# Altium schematic sheet APC1_OBC.SchDoc
size A4
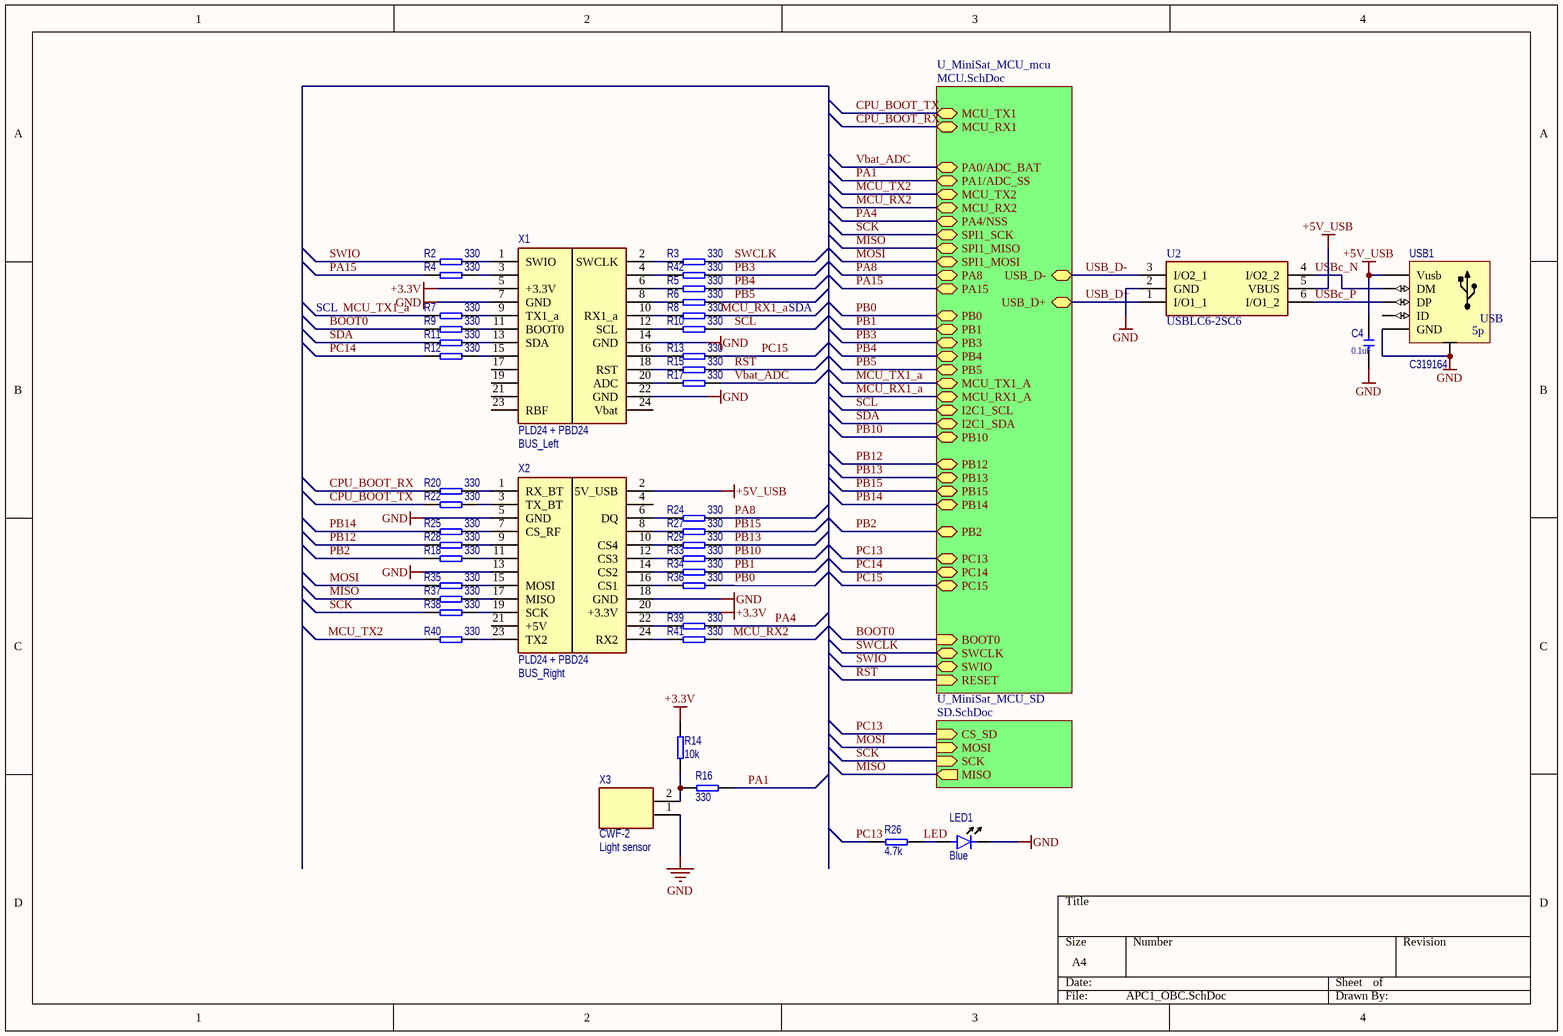
[diagram p0: APC1_OBC.SchDoc]

## Parts
C4  value 0.1uF  [CERCAP 0402]
LED1  value Blue  [LED 0603]
R2  value 330  [RES 0402]
R3  value 330  [RES 0402]
R4  value 330  [RES 0402]
R5  value 330  [RES 0402]
R6  value 330  [RES 0402]
R7  value 330  [RES 0402]
R8  value 330  [RES 0402]
R9  value 330  [RES 0402]
R10  value 330  [RES 0402]
R11  value 330  [RES 0402]
R12  value 330  [RES 0402]
R13  value 330  [RES 0402]
R14  value 10k  [RES 0402]
R15  value 330  [RES 0402]
R16  value 330  [RES 0603]
R17  value 330  [RES 0402]
R18  value 330  [RES 0402]
R20  value 330  [RES 0402]
R22  value 330  [RES 0402]
R24  value 330  [RES 0402]
R25  value 330  [RES 0402]
R26  value 4.7k  [RES 0402]
R27  value 330  [RES 0402]
R28  value 330  [RES 0402]
R29  value 330  [RES 0402]
R33  value 330  [RES 0402]
R34  value 330  [RES 0402]
R35  value 330  [RES 0402]
R36  value 330  [RES 0402]
R37  value 330  [RES 0402]
R38  value 330  [RES 0402]
R39  value 330  [RES 0402]
R40  value 330  [RES 0402]
R41  value 330  [RES 0402]
R42  value 330  [RES 0402]
U2  USBLC6-2SC6  [SOT-666]
USB1  C319164  [USB-Micro_TH]
X1  PLD24 + PBD24  Purpose: BUS_Left  [PICOSAT_CNN]
X2  PLD24 + PBD24  Purpose: BUS_Right  [PICOSAT_CNN]
X3  CWF-2  Purpose: Light sensor  [PBS-2-2.54]

## Sub-sheets
U_MiniSat_MCU_mcu = MCU.SchDoc: RESET (in), USB_D+ (bidir), USB_D- (bidir), PB12 (bidir), PB3 (bidir), PB5 (bidir), PA15 (bidir), PB0 (bidir), PB1 (bidir), PB4 (bidir), PB10 (bidir), PA0/ADC_BAT (bidir), PA1/ADC_SS (bidir), PA8 (bidir), SWIO (bidir), SWCLK (bidir), PC13 (bidir), PC15 (bidir), PC14 (bidir), PB13 (bidir), PB15 (bidir), PB14 (bidir), BOOT0 (in), I2C1_SDA (bidir), PA4/NSS (bidir), MCU_TX1 (bidir), MCU_RX1 (bidir), MCU_TX2 (bidir), MCU_RX2 (bidir), PB2 (bidir), SPI1_SCK (bidir), SPI1_MOSI (bidir), SPI1_MISO (bidir), I2C1_SCL (bidir), MCU_RX1_A (bidir), MCU_TX1_A (bidir)
U_MiniSat_MCU_SD = SD.SchDoc: CS_SD (in), MOSI (in), SCK (in), MISO (out)

## Nets
+3.3V: R14.2 X1.5(+3.3V) X2.20(+3.3V)
+5V_USB: C4.2 U2.5(VBUS) USB1.Vusb X2.2(5V_USB)
GND: C4.1 LED1.2(Cathode) U2.2(GND) USB1.GND USB1.TH X1.7(GND) X1.14(GND) X1.22(GND) X2.5(GND) X2.13 X2.18(GND) X3.1
BOOT0: R9.1 ; sheet U_MiniSat_MCU_mcu/BOOT0
CPU_BOOT_RX: R20.1 ; sheet U_MiniSat_MCU_mcu/MCU_RX1
CPU_BOOT_TX: R22.1 ; sheet U_MiniSat_MCU_mcu/MCU_TX1
LED: LED1.1(Anode) R26.2
MCU_RX1_a: R8.2 ; sheet U_MiniSat_MCU_mcu/MCU_RX1_A
MCU_RX2: R41.2 ; sheet U_MiniSat_MCU_mcu/MCU_RX2
MCU_TX1_a: R7.1 ; sheet U_MiniSat_MCU_mcu/MCU_TX1_A
MCU_TX2: R40.1 ; sheet U_MiniSat_MCU_mcu/MCU_TX2
MISO: R37.1 ; sheet U_MiniSat_MCU_mcu/SPI1_MISO, sheet U_MiniSat_MCU_SD/MISO
MOSI: R35.1 ; sheet U_MiniSat_MCU_mcu/SPI1_MOSI, sheet U_MiniSat_MCU_SD/MOSI
PA1: R16.1 ; sheet U_MiniSat_MCU_mcu/PA1/ADC_SS
PA4: R39.2 ; sheet U_MiniSat_MCU_mcu/PA4/NSS
PA8: R24.2 ; sheet U_MiniSat_MCU_mcu/PA8
PA15: R4.1 ; sheet U_MiniSat_MCU_mcu/PA15
PB0: R36.2 ; sheet U_MiniSat_MCU_mcu/PB0
PB1: R34.2 ; sheet U_MiniSat_MCU_mcu/PB1
PB2: R18.1 ; sheet U_MiniSat_MCU_mcu/PB2
PB3: R42.2 ; sheet U_MiniSat_MCU_mcu/PB3
PB4: R5.2 ; sheet U_MiniSat_MCU_mcu/PB4
PB5: R6.2 ; sheet U_MiniSat_MCU_mcu/PB5
PB10: R33.2 ; sheet U_MiniSat_MCU_mcu/PB10
PB12: R28.1 ; sheet U_MiniSat_MCU_mcu/PB12
PB13: R29.2 ; sheet U_MiniSat_MCU_mcu/PB13
PB14: R25.1 ; sheet U_MiniSat_MCU_mcu/PB14
PB15: R27.2 ; sheet U_MiniSat_MCU_mcu/PB15
PC13: R26.1 ; sheet U_MiniSat_MCU_mcu/PC13, sheet U_MiniSat_MCU_SD/CS_SD
PC14: R12.1 ; sheet U_MiniSat_MCU_mcu/PC14
PC15: R13.2 ; sheet U_MiniSat_MCU_mcu/PC15
RST: R15.2 ; sheet U_MiniSat_MCU_mcu/RESET
SCK: R38.1 ; sheet U_MiniSat_MCU_mcu/SPI1_SCK, sheet U_MiniSat_MCU_SD/SCK
SCL: R10.2 ; sheet U_MiniSat_MCU_mcu/I2C1_SCL
SDA: R11.1 ; sheet U_MiniSat_MCU_mcu/I2C1_SDA
SWCLK: R3.2 ; sheet U_MiniSat_MCU_mcu/SWCLK
SWIO: R2.1 ; sheet U_MiniSat_MCU_mcu/SWIO
USB_D+: U2.1(I/O1_1) ; sheet U_MiniSat_MCU_mcu/USB_D+
USB_D-: U2.3(I/O2_1) ; sheet U_MiniSat_MCU_mcu/USB_D-
USBc_N: U2.4(I/O2_2) USB1.DM
USBc_P: U2.6(I/O1_2) USB1.DP
Vbat_ADC: R17.2 ; sheet U_MiniSat_MCU_mcu/PA0/ADC_BAT
NetR2_2: R2.2 X1.1(SWIO)
NetR3_1: R3.1 X1.2(SWCLK)
NetR4_2: R4.2 X1.3
NetR5_1: R5.1 X1.6
NetR6_1: R6.1 X1.8
NetR7_2: R7.2 X1.9(TX1_a)
NetR8_1: R8.1 X1.10(RX1_a)
NetR9_2: R9.2 X1.11(BOOT0)
NetR10_1: R10.1 X1.12(SCL)
NetR11_2: R11.2 X1.13(SDA)
NetR12_2: R12.2 X1.15
NetR13_1: R13.1 X1.16
NetR14_1: R14.1 R16.2 X3.2
NetR15_1: R15.1 X1.18(RST)
NetR17_1: R17.1 X1.20(ADC)
NetR18_2: R18.2 X2.11
NetR20_2: R20.2 X2.1(RX_BT)
NetR22_2: R22.2 X2.3(TX_BT)
NetR24_1: R24.1 X2.6(DQ)
NetR25_2: R25.2 X2.7(CS_RF)
NetR27_1: R27.1 X2.8
NetR28_2: R28.2 X2.9
NetR29_1: R29.1 X2.10(CS4)
NetR33_1: R33.1 X2.12(CS3)
NetR34_1: R34.1 X2.14(CS2)
NetR35_2: R35.2 X2.15(MOSI)
NetR36_1: R36.1 X2.16(CS1)
NetR37_2: R37.2 X2.17(MISO)
NetR38_2: R38.2 X2.19(SCK)
NetR39_1: R39.1 X2.22
NetR40_2: R40.2 X2.23(TX2)
NetR41_1: R41.1 X2.24(RX2)
NetR42_1: R42.1 X1.4

Not connected (* = marked no-connect by the designer): USB1 ID; X1 17 19 21 23(RBF) 24(Vbat); X2 4 21(+5V)

## Notes on the sheet
- SCL
- SDA
- (in symbol USB(5p)) USB; 5p

## Library data of the parts
C4 = !Capacitor: Capacitor; IsSMT: NoSMT; Diel: X7R; Voltage: *
LED1 = LED: Light Emittering Diode; IsSMT: NoSMT
R2-R18 R20 R22 R24-R29 R33-R42 = !Resistor: Resistor; IsSMT: NoSMT
U2 = USBLC6-2SC6: Integrated Circuit; HelpURL: https://datasheet.lcsc.com/szlcsc/STMicroelectronics-USBLC6-2SC6_C7519.pdf; Order: USBLC6-2SC6; LCSC Part #: C7519; JLCPCB Placement: Extended
USB1 = USB(5p): USB 5-pin; IsSMT: NoSMT
X1 X2 = Header 2x12: 10x2 header; IsSMT: NoSMT
X3 = Header 1x2: 2x1 header; isSMT: NoSMT